# Altium schematic sheet LDO_5V.SchDoc
size A
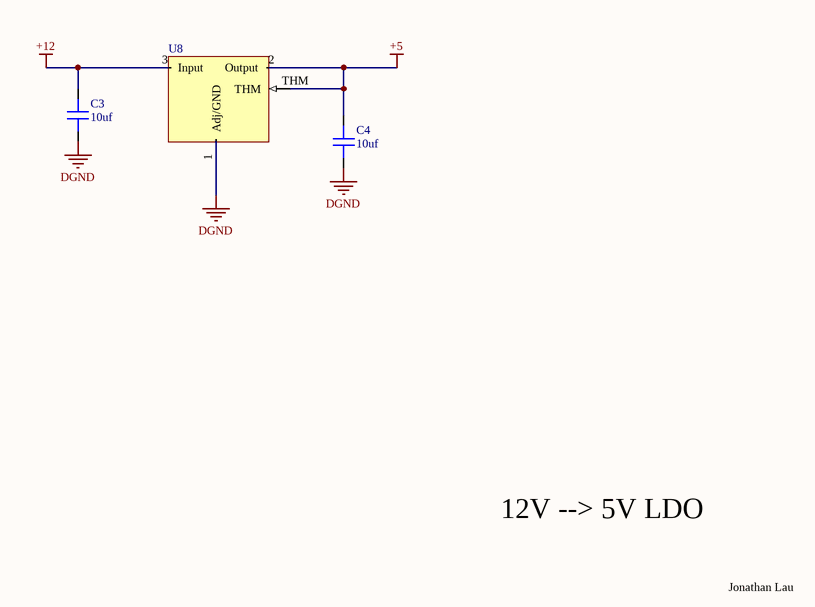
[diagram p0: LDO_5V.SchDoc]

## Parts
C3  value 10uf  [CAP 0805/2012]  (hidden comment: Capacitor MLCC 10uf 16V CAP 0805/2012)
C4  value 10uf  [CAP 0805/2012]  (hidden comment: Capacitor MLCC 10uf 16V CAP 0805/2012)
U8  NCP1117ST50T3G  [SOT-223-3]  (value not drawn)

## Nets
+5: C4.2 U8.2(Output) U8.THM
+12: C3.2 U8.3(Input)
DGND: C3.1 C4.1 U8.1(Adj/GND)

## Notes on the sheet
- 12V --> 5V LDO
- Jonathan Lau

## Library data of the parts
C3 C4 = 355: Manufacturer_id: 1; idCapacitor: 355; Name: Cap_10uf_16V_CAP 0805/2012; Dielectric: Ceramic; Created_By: Nick Mah; Drawer_id: 1; Voltage_Rating: 16V; Package: CAP 0805/2012; Created_Date: 10/20/2018
U8 = 16: Linear Voltage Regulator IC Positive Fixed 1 Output 5V 1A SOT-223; Manufacturer_id: 1; idPMIC_Lin: 16; Name: 5V 1A LDO; Value: 5V 1.0A; Output_Config: 5V Fixed; Vin(Max): 20V; Vout(Min): 4.95; Vout(Max): 5.05; Dropout_Voltage: 1.2V @ 800mA; Created_By: Angel Delgado; Drawer_id: 1; Num_Outputs: 1; Vout_Type: Fixed; Current_Rating: 1A; Package: SOT-223-3; MfrPartNo: NCP1117ST50T3G; Link: https://www.digikey.com/product-detail/en/on-semiconductor/NCP1117ST50T3G/NCP1117ST50T3GOSCT-ND/1967217; ComponentLink1Description: Datasheet; ComponentLink1URL: https://www.onsemi.com/pub/Collateral/NCP1117-D.PDF